# Altium schematic sheet efr32_ioport.SchDoc
size A; SheetNumber: 3; SheetTotal: 8
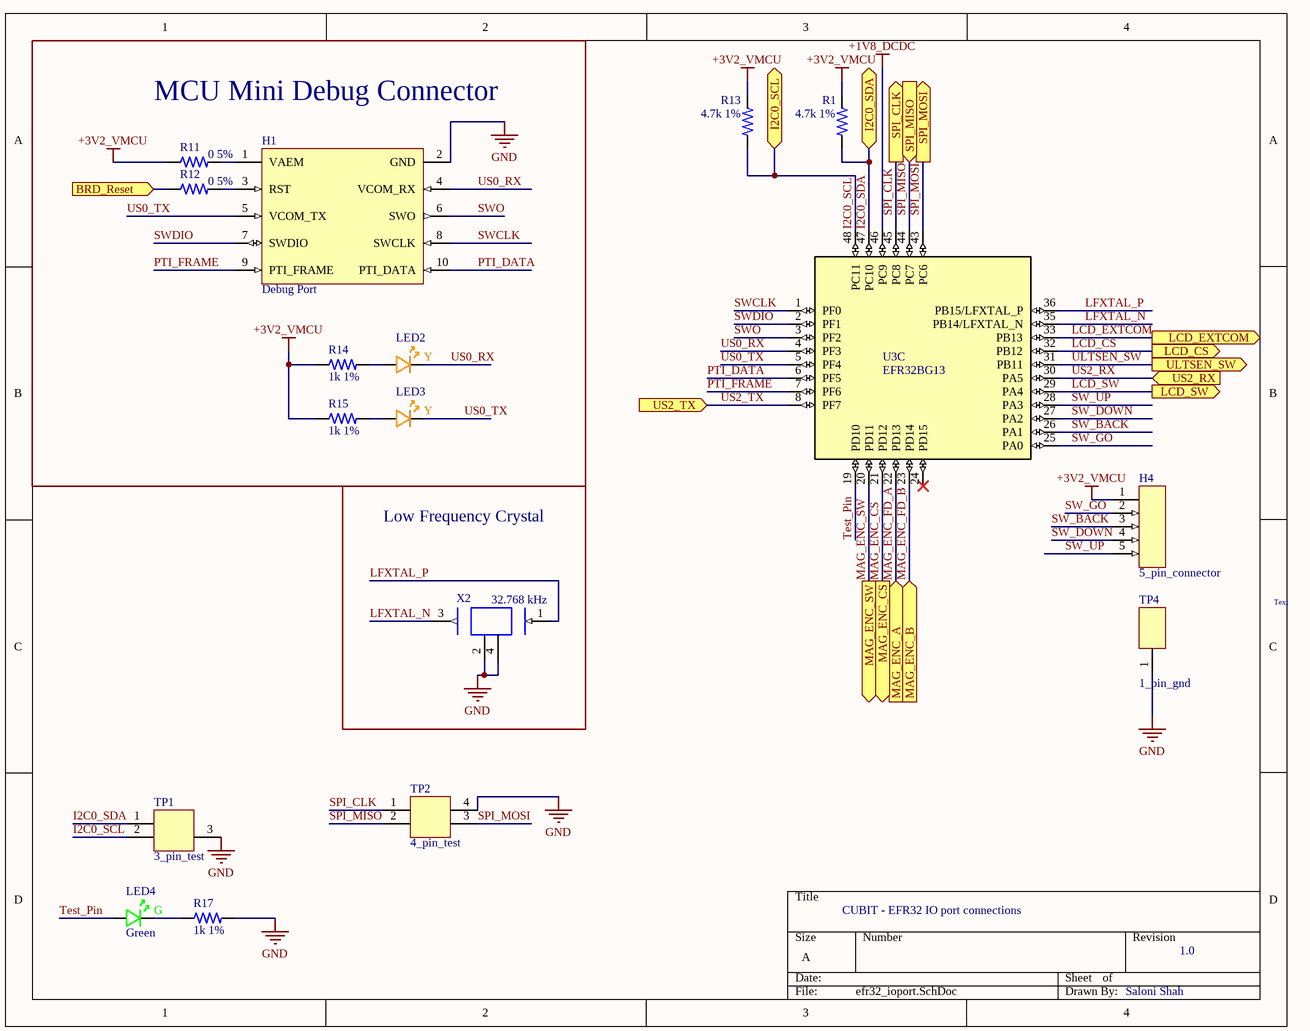
[diagram p0: efr32_ioport.SchDoc]

## Parts
H1  Debug Port  [Amphenol_20021121_0]
H4  5_pin_connector  [5_PIN_100MIL]
LED2  150060YS75000  [LED_0603_RED_WL-SMCW]  (value not drawn)
LED3  150060YS75000  [LED_0603_RED_WL-SMCW]  (value not drawn)
LED4  Green  [LED_0603_RED_WL-SMCW]
R1  4.7k 1%  [CAP_0603_1MM]
R11  0 5%  [CAP_0402_1mm]
R12  0 5%  [CAP_0402_1mm]
R13  4.7k 1%  [CAP_0603_1MM]
R14  1k 1%  [2_Chip_0603_RMCF]
R15  1k 1%  [2_Chip_0603_RMCF]
R17  1k 1%  [2_Chip_0603_RMCF]
TP1  3_pin_test  [3_PIN_100mil]
TP2  4_pin_test  [4_PIN_100MIL]
TP4  1_pin_gnd  [1_PIN_100MIL]
U3  EFR32BG13  [48-QFN_7x7]  (part C of 3)
X2  32.768 kHz  [OSC_ASDDV-48.000MHZ-LC-T]

## Blocks framed on the sheet
MCU Mini Debug Connector: H1 LED2 LED3 R11 R12 R14 R15
Low Frequency Crystal: X2

## Ports
BRD_Reset (in), I2C0_SCL (bidir), I2C0_SDA (bidir), LCD_CS (out), LCD_EXTCOM (out), LCD_SW (out), MAG_ENC_A (in), MAG_ENC_B (in), MAG_ENC_CS (out), MAG_ENC_SW (out), SPI_CLK (out), SPI_MISO (in), SPI_MOSI (out), ULTSEN_SW (out), US2_RX (in), US2_TX (in)

## Nets
+1V8_DCDC: U3.46(PC9)
+3V2_VMCU: H4.1 R1.1 R11.1 R13.1 R14.1 R15.1
GND: H1.2(GND) R17.2 TP1.3 TP2.4 TP4.1 X2.2 X2.4
BRD_Reset: R12.1 ; port BRD_Reset
I2C0_SCL: R13.2 TP1.2 U3.48(PC11) ; port I2C0_SCL
I2C0_SDA: R1.2 TP1.1 U3.47(PC10) ; port I2C0_SDA
LCD_CS: U3.32(PB12) ; port LCD_CS
LCD_EXTCOM: U3.33(PB13) ; port LCD_EXTCOM
LCD_SW: U3.29(PA4) ; port LCD_SW
LFXTAL_N: U3.35(PB14/LFXTAL_N) X2.3
LFXTAL_P: U3.36(PB15/LFXTAL_P) X2.1
MAG_ENC_CS: U3.21(PD12) ; port MAG_ENC_CS
MAG_ENC_FD_A: U3.22(PD13) ; port MAG_ENC_A
MAG_ENC_FD_B: U3.23(PD14) ; port MAG_ENC_B
MAG_ENC_SW: U3.20(PD11) ; port MAG_ENC_SW
PTI_DATA: H1.10(PTI_DATA) U3.6(PF5)
PTI_FRAME: H1.9(PTI_FRAME) U3.7(PF6)
SPI_CLK: TP2.1 U3.45(PC8) ; port SPI_CLK
SPI_MISO: TP2.2 U3.44(PC7) ; port SPI_MISO
SPI_MOSI: TP2.3 U3.43(PC6) ; port SPI_MOSI
SW_BACK: H4.3 U3.26(PA1)
SW_DOWN: H4.4 U3.27(PA2)
SW_GO: H4.2 U3.25(PA0)
SW_UP: H4.5 U3.28(PA3)
SWCLK: H1.8(SWCLK) U3.1(PF0)
SWDIO: H1.7(SWDIO) U3.2(PF1)
SWO: H1.6(SWO) U3.3(PF2)
Test_Pin: LED4.A U3.19(PD10)
ULTSEN_SW: U3.31(PB11) ; port ULTSEN_SW
US0_RX: H1.4(VCOM_RX) LED2.C U3.4(PF3)
US0_TX: H1.5(VCOM_TX) LED3.C U3.5(PF4)
US2_RX: U3.30(PA5) ; port US2_RX
US2_TX: U3.8(PF7) ; port US2_TX
NetH1_1: H1.1(VAEM) R11.2
NetH1_3: H1.3(RST) R12.2
NetLED2_A: LED2.A R14.2
NetLED3_A: LED3.A R15.2
NetLED4_C: LED4.C R17.1

Not connected (* = marked no-connect by the designer): U3 24(PD15)*

## Notes on the sheet
- Text
- CUBIT - EFR32 IO port connections
- 1.0
- Saloni Shah
- (in symbol 150060YS75000) Y
- (in symbol QBLP601-AG1) G

## Library data of the parts
H1 = 20021121-00010C1LF: CONN HEADER SMD 10POS 1.27MM. Connector Header Surface Mount 10 position 0.050"; Manufacturer: Amphenol ICC / FCI; Supplier 1: Digi-Key; Manufacturer Part Number: 20021121-00010C1LF; RoHS: No; Category: Headers and Wire Housings
LED2 LED3 = 150060YS75000: Led, Yellow, 590 Nm, 2 V, 30 Ma, 120 Mcd Rohs Compliant: Yes; Manufacturer: Wurth Electronics; Viewing Angle: 140°; Lens Style: Clear,Rectangular; Wavelength: 590nm; Luminous Intensity: 120mcd; Forward Voltage: 2V; Forward Current: 30mA; Test Current: 20mA; Supplier 1: Digi-Key; Manufacturer Part Number: 150060YS75000; RoHS: Yes; Category: LEDs; Stock 1: 255; Pricing 1: 1=0.15000, 50=0.13800, 100=0.11800, 500=0.10200 (USD); Mount: Surface Mount; Case/Package: 0603; Case Code (Metric): 1608; Case Code (Imperial): 0603; Color: Yellow; Min Operating Temperature: -40°C; Max Operating Temperature: 85°C; Package Quantity: 4000; Packaging: Tape and Reel; Dominant Wavelength: 590nm; Length: 1.6mm; Width: 0.8mm; Height: 0.7mm; REACH SVHC: Unknown; RoHS Compliant: Yes; ComponentLink1URL: https://datasheet.ciiva.com/23843/150060ys75000-23843250.pdf?src-supplier=Newark; ComponentLink1Description: https://datasheet.ciiva.com/23843/150060ys75000-23843250.pdf?src-supplier=Newark; ComponentLink2URL: https://datasheet.ciiva.com/29279/759432-da-01-en-chipled-0603-w-kl-gelb-150060ys75000-29279206.pdf?src-supplier=Conrad; ComponentLink2Description: https://datasheet.ciiva.com/29279/759432-da-01-en-chipled-0603-w-kl-gelb-150060ys75000-29279206.pdf?src-supplier=Conrad; ComponentLink3URL: https://datasheet.ciiva.com/48430/150060ys75000-eng-tds-48430044.pdf?src-supplier=Distrelec; ComponentLink3Description: https://datasheet.ciiva.com/48430/150060ys75000-eng-tds-48430044.pdf?src-supplier=Distrelec; ComponentLink4URL: https://datasheet.ciiva.com/29563/150060ys75000-29563033.pdf?src-supplier=Digi-Key; ComponentLink4Description: https://datasheet.ciiva.com/29563/150060ys75000-29563033.pdf?src-supplier=Digi-Key; ComponentLink5URL: https://datasheet.ciiva.com/29563/150060ys75000-29563045.pdf?src-supplier=Digi-Key; ComponentLink5Description: https://datasheet.ciiva.com/29563/150060ys75000-29563045.pdf?src-supplier=Digi-Key; ComponentLink6URL: https://datasheet.ciiva.com/22656/1911348-22656951.pdf?src-supplier=Element14; ComponentLink6Description: https://datasheet.ciiva.com/22656/1911348-22656951.pdf?src-supplier=Element14
LED4 = QBLP601-AG1: Led Green Clear 0603 SMD; Manufacturer: QT-Brightek; Supplier 1: Digi-Key; Manufacturer Part Number: QBLP601-AG1; RoHS: No; Stock 1: 5990; Pricing 1: 1=0.35000, 10=0.19000, 100=0.08820, 500=0.08140, 1000=0.06377, 2000=0.06242 (USD)
R1 R13 = AF0603FR-074K7L: Res Thick Film 0603 4.7K Ohm 1% 1/10W ±100ppm/°C Molded SMD Paper T/R; Manufacturer: Yageo; Resistance: 4.7kR; Power Rating: 100mW; Voltage Rating: 75V; Supplier 1: Digi-Key; Manufacturer Part Number: AF0603FR-074K7L; RoHS: Yes; Category: Chip SMD Resistors; Stock 1: 6660; Pricing 1: 1=0.10000, 10=0.06100, 100=0.02470, 1000=0.01109, 2500=0.00963 (USD); Case/Package: 0603; Case Code (Imperial): 0603; Case Code (Metric): 1608; Weight: 7.1E-05oz; Min Operating Temperature: -55°C; Max Operating Temperature: 155°C; Tolerance: 1%; Packaging: Tape and Reel; Resistor Type: Thick Film; Number of Terminations: 2; Package Quantity: 5000; Termination: SMD/SMT; Max Power Dissipation: 100mW; Temperature Coefficient: 100ppm/°C; Features: Moisture Resistant,Anti-Sulfur; Length: 0.063inch; Width: 0.031inch; Height: 0.022inch; RoHS Compliant: Yes; ComponentLink1URL: http://www.mouser.com/ds/2/447/PYu-AF_51_RoHS_L_5-1085711.pdf?src-supplier=Mouser; ComponentLink1Description: http://www.mouser.com/ds/2/447/PYu-AF_51_RoHS_L_5-1085711.pdf?src-supplier=Mouser; ComponentLink2URL: http://www.yageo.com/documents/recent/PYu-AF_51_RoHS_L_5.pdf?src-supplier=Digi-Key; ComponentLink2Description: http://www.yageo.com/documents/recent/PYu-AF_51_RoHS_L_5.pdf?src-supplier=Digi-Key
R11 R12 = RC1005J000CS: Res 0 Ohms ±5% 0.063 W 0402 Thick Film Surface Mount Chip Resistor; Manufacturer: Samsung; Resistance: 0R; Power Rating: 63mW; Temperature Coefficient: 200ppm/°C; Voltage Rating (DC): 50V; Supplier 1: Digi-Key; Manufacturer Part Number: RC1005J000CS; RoHS: Yes; Category: Chip SMD Resistors; Stock 1: 580; Pricing 1: 1=0.10000, 10=0.04200, 25=0.03040, 50=0.02300, 100=0.01700, 250=0.01296, 500=0.01036, 1000=0.00763, 5000=0.00547 (USD); Mount: Surface Mount; Case/Package: 0402; Case Code (Metric): 1005; Case Code (Imperial): 0402; Contact Plating: Tin; Size Code: 0402; Min Operating Temperature: -55°C; Max Operating Temperature: 125°C; Packaging: Tape and Reel; Tolerance: 5%; Resistor Type: Thick Film; Number of Terminations: 2; Max Power Dissipation: 63mW; Features: Moisture Resistant; Series: RC; Construction: Rectangular; Length: 1mm; Width: 0.02inch; Height: 0.016inch; Depth: 0.5mm; Radiation Hardening: No; Military Standard: Not; Lead Free: Lead Free; RoHS Compliant: Yes; ComponentLink1URL: https://datasheet.ciiva.com/15196/getdatasheetpartid-499011-15196236.pdf?src-supplier=Verical; ComponentLink1Description: https://datasheet.ciiva.com/15196/getdatasheetpartid-499011-15196236.pdf?src-supplier=Verical; ComponentLink2URL: https://datasheet.ciiva.com/16449/rcseries-16449310.pdf?src-supplier=Future+Electronics; ComponentLink2Description: https://datasheet.ciiva.com/16449/rcseries-16449310.pdf?src-supplier=Future+Electronics
R14 R15 R17 = RMCF0603FT1K00: Res 1K Ohm 1% 0.1W(1/10W) ±100ppm/C Pad SMD Automotive T/R; Manufacturer: Stackpole Electronics; Resistance: 1kR; Power Rating: 100mW; Temperature Coefficient: 100ppm/°C; Supplier 1: Digi-Key; Manufacturer Part Number: RMCF0603FT1K00; RoHS: Yes; Category: Chip SMD Resistors; Pricing 1: 1=0.10000, 10=0.01700, 100=0.00680, 1000=0.00305, 2500=0.00264 (USD); Mount: Surface Mount; Case/Package: 0603; Case Code (Metric): 1608; Case Code (Imperial): 0603; Contact Plating: Tin,Matte; Size Code: 0603; Min Operating Temperature: -55°C; Max Operating Temperature: 155°C; Tolerance: 1%; Packaging: Tape and Reel; Resistor Type: Thick Film; Number of Terminations: 2; Max Power Dissipation: 100mW; Features: Automotive AEC-Q200; Series: RMCF; Construction: Rectangular; Length: 1.55mm; Width: 0.031inch; Height: 0.022inch; Depth: 0.8mm; Radiation Hardening: No; Military Standard: Not; Lead Free: Lead Free; RoHS Compliant: Yes; ComponentLink1URL: https://www.seielect.com/catalog/sei-rmcf_rmcp.pdf?src-supplier=Digi-Key; ComponentLink1Description: https://www.seielect.com/catalog/sei-rmcf_rmcp.pdf?src-supplier=Digi-Key; ComponentLink2URL: https://www.seielect.com/catalog/SEI-RMCF_RMCP.pdf?src-supplier=Avnet; ComponentLink2Description: https://www.seielect.com/catalog/SEI-RMCF_RMCP.pdf?src-supplier=Avnet; ComponentLink3URL: https://www.seielect.com/catalog/SEI-Packaging.pdf?src-supplier=Avnet; ComponentLink3Description: https://www.seielect.com/catalog/SEI-Packaging.pdf?src-supplier=Avnet; ComponentLink4URL: https://www.seielect.com/catalog/SEI-Packaging.pdf?src-supplier=Arrow+Electronics; ComponentLink4Description: https://www.seielect.com/catalog/SEI-Packaging.pdf?src-supplier=Arrow+Electronics; ComponentLink5URL: https://www.seielect.com/catalog/SEI-RMCF_RMCP.pdf?src-supplier=Avnet+Asia; ComponentLink5Description: https://www.seielect.com/catalog/SEI-RMCF_RMCP.pdf?src-supplier=Avnet+Asia; ComponentLink6URL: http://www.seielect.com/Catalog/SEI-rmc.pdf?src-supplier=Future+Electronics; ComponentLink6Description: http://www.seielect.com/Catalog/SEI-rmc.pdf?src-supplier=Future+Electronics; ComponentLink7URL: https://www.seielect.com/catalog/SEI-Packaging.pdf?src-supplier=Verical; ComponentLink7Description: https://www.seielect.com/catalog/SEI-Packaging.pdf?src-supplier=Verical; ComponentLink8URL: https://www.seielect.com/catalog/SEI-Packaging.pdf?src-supplier=Quest; ComponentLink8Description: https://www.seielect.com/catalog/SEI-Packaging.pdf?src-supplier=Quest
U3 = EFR32BG13P732F512GM48-D: Blue Gecko QFN48 2.4 G 19 dB BLE/Proprietary 512 kB 64 kB(RAM) 31GPIO; Manufacturer: Silicon Labs; Supplier 1: Digi-Key; Manufacturer Part Number: EFR32BG13P732F512GM48-D; RoHS: Yes; Category: RF Receivers, Transceivers; Pricing 1: 1=8.42000, 10=7.72000, 25=7.01800, 80=6.31625, 230=5.78987, 440=5.26350, 945=4.78499 (USD); ComponentLink1URL: http://www.farnell.com/datasheets/2813683.pdf?src-supplier=Farnell; ComponentLink1Description: http://www.farnell.com/datasheets/2813683.pdf?src-supplier=Farnell
X2 = ASDK2-32.768KHZ-LR-T3: Oscillator XO 0.032768MHz ±25ppm 15pF CMOS 60% 1.8V 4-Pin SMD T/R; Manufacturer: Abracon; Max Supply Current: 1.5mA; Supplier 1: Digi-Key; Manufacturer Part Number: ASDK2-32.768KHZ-LR-T3; RoHS: Yes; Category: Oscillators; Stock 1: 8544; Pricing 1: 1=0.97000, 10=0.86100, 50=0.80500, 100=0.71140, 500=0.67392, 1000=0.56160 (USD); Mount: Surface Mount; Case/Package: SMD/SMT; Min Operating Temperature: -40°C; Max Operating Temperature: 85°C; Packaging: Cut Tape; Frequency: 32.768kHz; Frequency Stability: 25ppm; Length: 0.098inch; Width: 0.079inch; Height: 0.037inch; ComponentLink1URL: http://www.farnell.com/datasheets/2581434.pdf?src-supplier=Farnell; ComponentLink1Description: http://www.farnell.com/datasheets/2581434.pdf?src-supplier=Farnell; ComponentLink2URL: https://abracon.com/Support/PackageDrawing/Oscillators/ASDK.PDF?src-supplier=Digi-Key; ComponentLink2Description: https://abracon.com/Support/PackageDrawing/Oscillators/ASDK.PDF?src-supplier=Digi-Key